# EAGLE design RGB LED 1.1 (EAGLE 5.04)
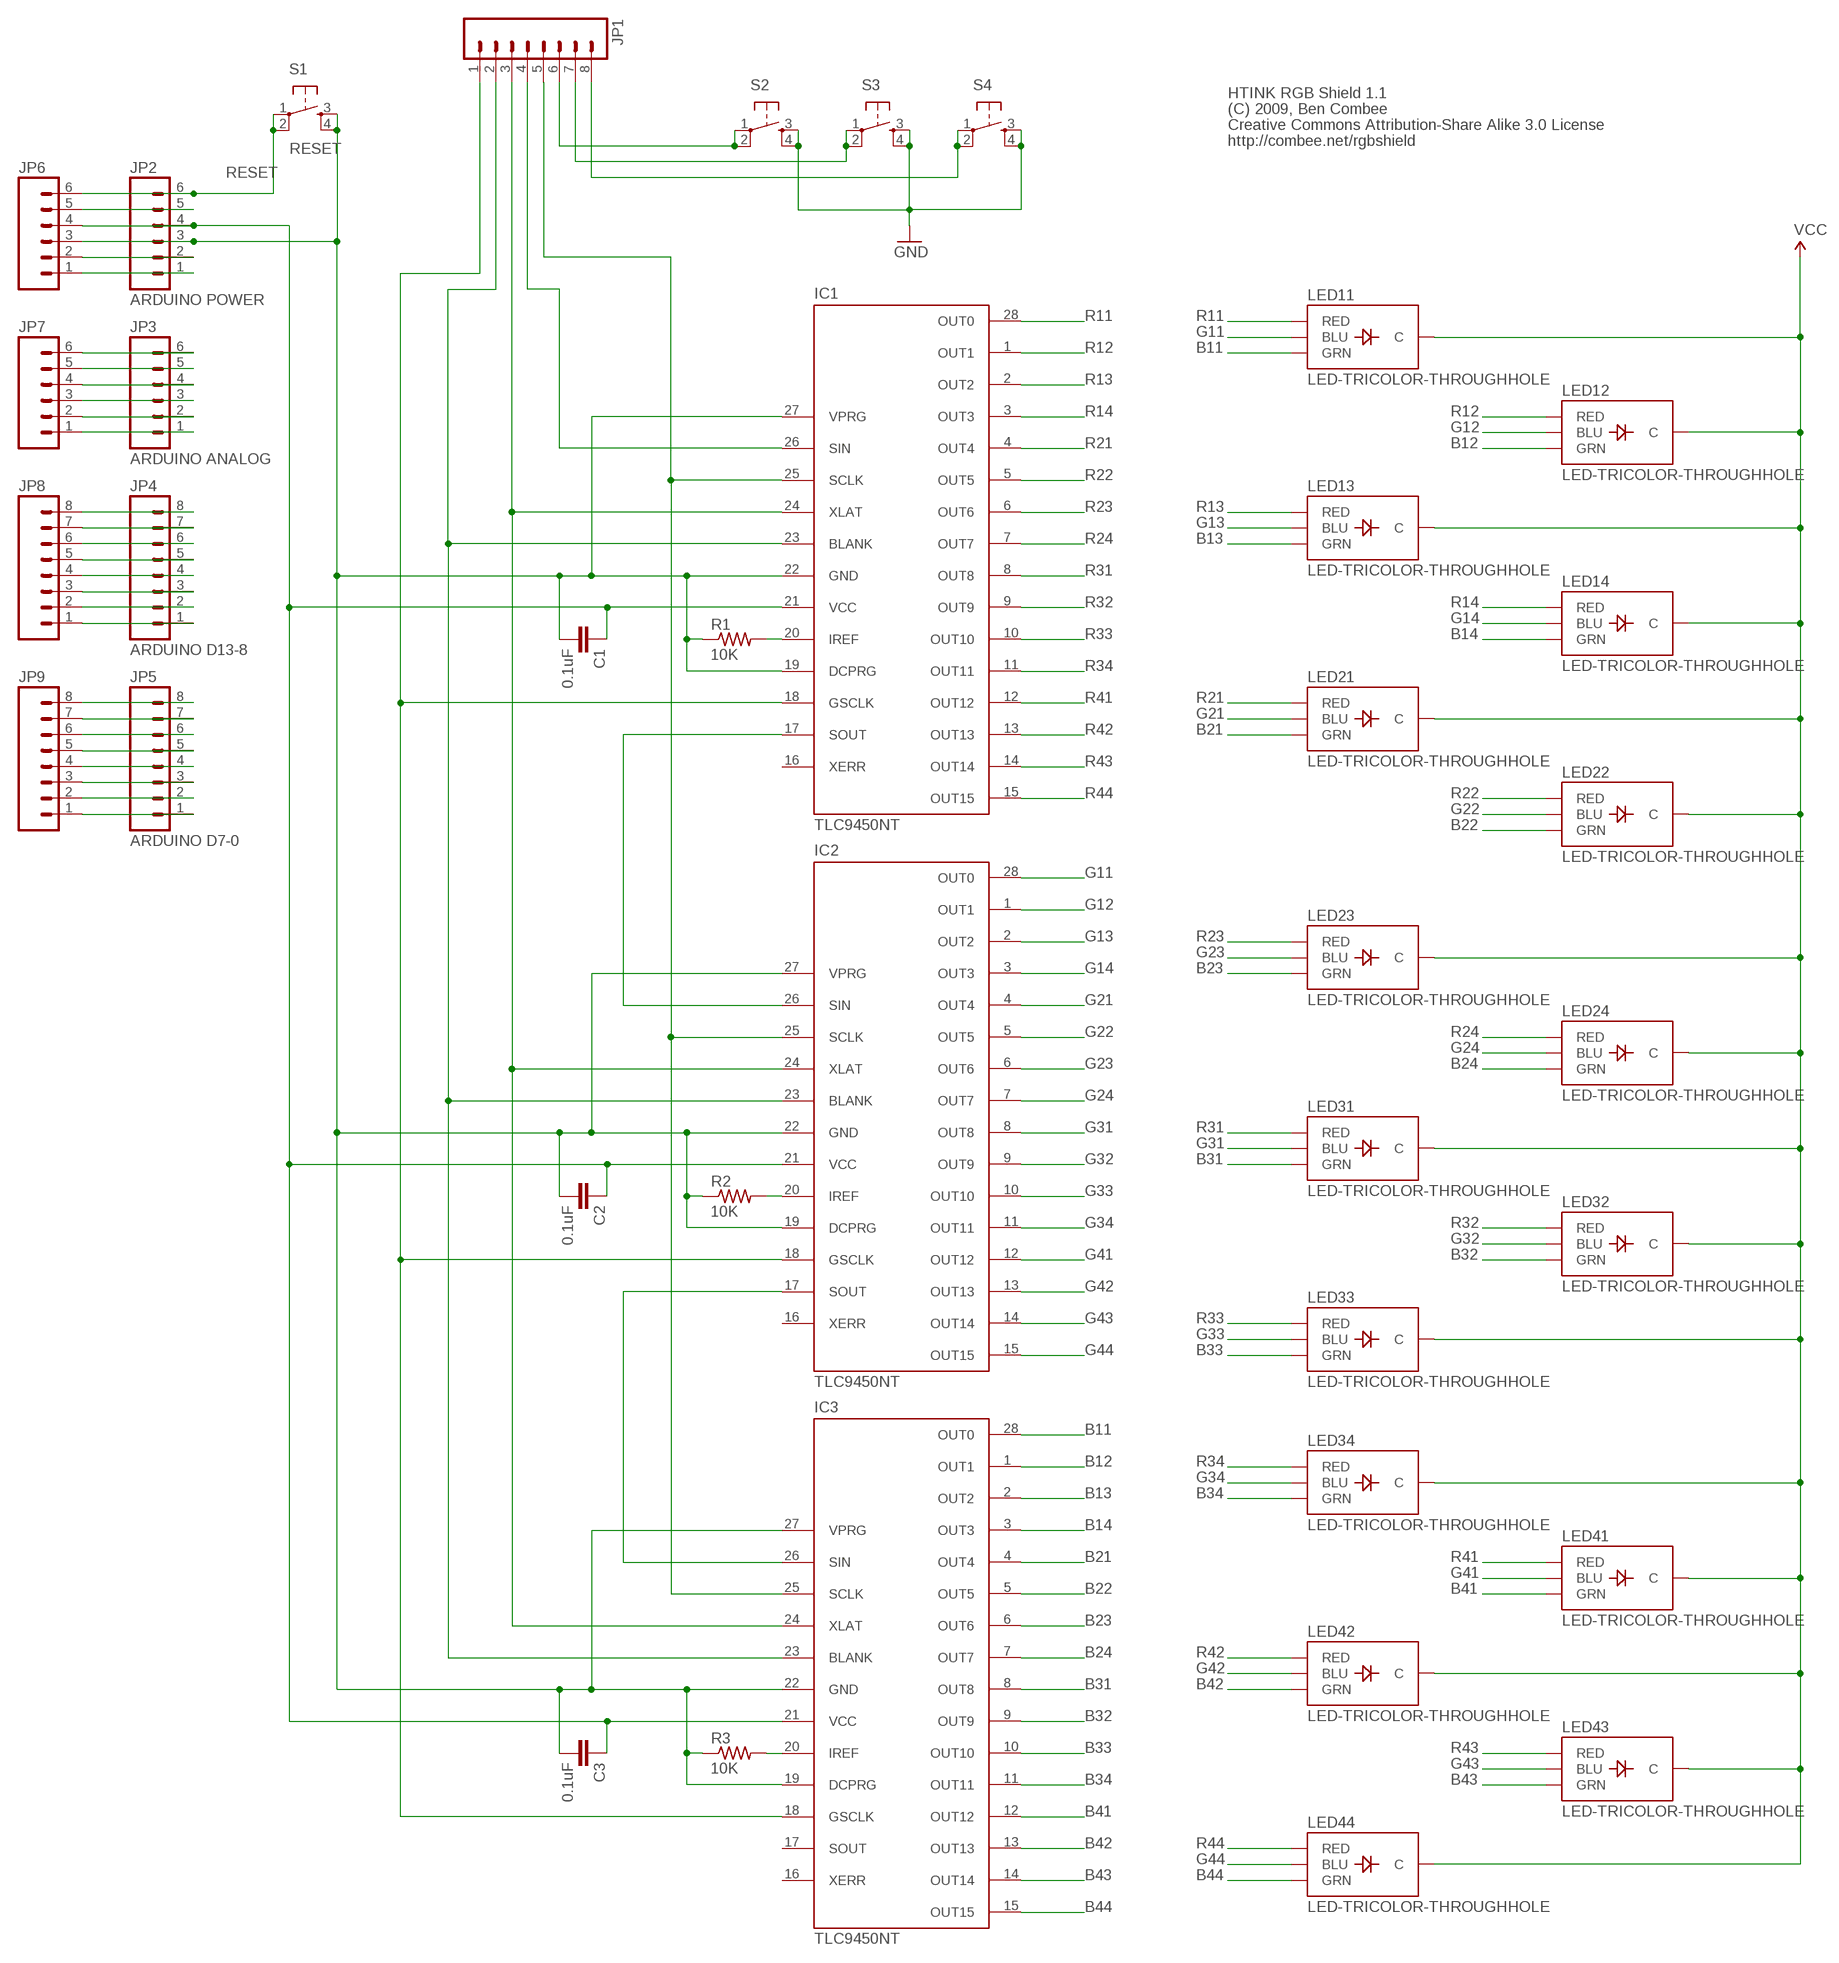
[diagram p0: schematic, sheet 1]

## Parts
C1  0.1uF  CAPPTH  [CAP-PTH-SMALL]
C2  0.1uF  CAPPTH  [CAP-PTH-SMALL]
C3  0.1uF  CAPPTH  [CAP-PTH-SMALL]
IC1  TLC9450NT  [DIL28-3]
IC2  TLC9450NT  [DIL28-3]
IC3  TLC9450NT  [DIL28-3]
JP1  M08LOCK  [1X08_LOCK]
JP2  ARDUINO POWER  M06LOCK  [1X06_LOCK]
JP3  ARDUINO ANALOG  M06LOCK  [1X06_LOCK]
JP4  ARDUINO D13-8  M08LOCK  [1X08_LOCK]
JP5  ARDUINO D7-0  M08LOCK  [1X08_LOCK]
JP6  M06LOCK  [1X06_LOCK]
JP7  M06LOCK  [1X06_LOCK]
JP8  M08LOCK  [1X08_LOCK]
JP9  M08LOCK  [1X08_LOCK]
LED11  LED-TRICOLOR-THROUGHHOLE  [LED-TRICOLOR-THROUGHHOLE]
LED12  LED-TRICOLOR-THROUGHHOLE  [LED-TRICOLOR-THROUGHHOLE]
LED13  LED-TRICOLOR-THROUGHHOLE  [LED-TRICOLOR-THROUGHHOLE]
LED14  LED-TRICOLOR-THROUGHHOLE  [LED-TRICOLOR-THROUGHHOLE]
LED21  LED-TRICOLOR-THROUGHHOLE  [LED-TRICOLOR-THROUGHHOLE]
LED22  LED-TRICOLOR-THROUGHHOLE  [LED-TRICOLOR-THROUGHHOLE]
LED23  LED-TRICOLOR-THROUGHHOLE  [LED-TRICOLOR-THROUGHHOLE]
LED24  LED-TRICOLOR-THROUGHHOLE  [LED-TRICOLOR-THROUGHHOLE]
LED31  LED-TRICOLOR-THROUGHHOLE  [LED-TRICOLOR-THROUGHHOLE]
LED32  LED-TRICOLOR-THROUGHHOLE  [LED-TRICOLOR-THROUGHHOLE]
LED33  LED-TRICOLOR-THROUGHHOLE  [LED-TRICOLOR-THROUGHHOLE]
LED34  LED-TRICOLOR-THROUGHHOLE  [LED-TRICOLOR-THROUGHHOLE]
LED41  LED-TRICOLOR-THROUGHHOLE  [LED-TRICOLOR-THROUGHHOLE]
LED42  LED-TRICOLOR-THROUGHHOLE  [LED-TRICOLOR-THROUGHHOLE]
LED43  LED-TRICOLOR-THROUGHHOLE  [LED-TRICOLOR-THROUGHHOLE]
LED44  LED-TRICOLOR-THROUGHHOLE  [LED-TRICOLOR-THROUGHHOLE]
R1  10K  R-US_0309/12  [0309/12]
R2  10K  R-US_0309/12  [0309/12]
R3  10K  R-US_0309/12  [0309/12]
S1  RESET  TAC_SWITCHPTH  [TACTILE-PTH]
S2  TAC_SWITCHPTH  [TACTILE-PTH]
S3  TAC_SWITCHPTH  [TACTILE-PTH]
S4  TAC_SWITCHPTH  [TACTILE-PTH]

## Nets
B11: IC3.28(OUT0) LED11.GRN
B12: IC3.1(OUT1) LED12.GRN
B13: IC3.2(OUT2) LED13.GRN
B14: IC3.3(OUT3) LED14.GRN
B21: IC3.4(OUT4) LED21.GRN
B22: IC3.5(OUT5) LED22.GRN
B23: IC3.6(OUT6) LED23.GRN
B24: IC3.7(OUT7) LED24.GRN
B31: IC3.8(OUT8) LED31.GRN
B32: IC3.9(OUT9) LED32.GRN
B33: IC3.10(OUT10) LED33.GRN
B34: IC3.11(OUT11) LED34.GRN
B41: IC3.12(OUT12) LED41.GRN
B42: IC3.13(OUT13) LED42.GRN
B43: IC3.14(OUT14) LED43.GRN
B44: IC3.15(OUT15) LED44.GRN
BLANK: IC1.23(BLANK) IC2.23(BLANK) IC3.23(BLANK) JP1.2
G11: IC2.28(OUT0) LED11.BLU
G12: IC2.1(OUT1) LED12.BLU
G13: IC2.2(OUT2) LED13.BLU
G14: IC2.3(OUT3) LED14.BLU
G21: IC2.4(OUT4) LED21.BLU
G22: IC2.5(OUT5) LED22.BLU
G23: IC2.6(OUT6) LED23.BLU
G24: IC2.7(OUT7) LED24.BLU
G31: IC2.8(OUT8) LED31.BLU
G32: IC2.9(OUT9) LED32.BLU
G33: IC2.10(OUT10) LED33.BLU
G34: IC2.11(OUT11) LED34.BLU
G41: IC2.12(OUT12) LED41.BLU
G42: IC2.13(OUT13) LED42.BLU
G43: IC2.14(OUT14) LED43.BLU
G44: IC2.15(OUT15) LED44.BLU
GND: C1.2 C2.2 C3.2 IC1.19(DCPRG) IC1.22(GND) IC1.27(VPRG) IC2.19(DCPRG) IC2.22(GND) IC2.27(VPRG) IC3.19(DCPRG) IC3.22(GND) IC3.27(VPRG) JP2.3 JP6.3 R1.1 R2.1 R3.1 S1.3 S1.4 S2.3 S2.4 S3.3 S3.4 S4.3 S4.4
GSCLK: IC1.18(GSCLK) IC2.18(GSCLK) IC3.18(GSCLK) JP1.1
N$1: IC1.17(SOUT) IC2.26(SIN)
N$2: IC2.17(SOUT) IC3.26(SIN)
N$3: JP1.6 S2.1 S2.2
N$4: IC3.20(IREF) R3.2
N$5: IC2.20(IREF) R2.2
N$6: IC1.20(IREF) R1.2
N$7: JP2.5 JP6.5
N$8: JP2.2 JP6.2
N$9: JP2.1 JP6.1
N$10: JP3.6 JP7.6
N$11: JP3.5 JP7.5
N$12: JP3.4 JP7.4
N$13: JP3.3 JP7.3
N$14: JP3.2 JP7.2
N$15: JP3.1 JP7.1
N$16: JP4.8 JP8.8
N$17: JP4.7 JP8.7
N$18: JP4.6 JP8.6
N$19: JP4.5 JP8.5
N$20: JP4.4 JP8.4
N$21: JP4.3 JP8.3
N$22: JP4.2 JP8.2
N$23: JP4.1 JP8.1
N$24: JP5.8 JP9.8
N$25: JP5.7 JP9.7
N$26: JP5.6 JP9.6
N$27: JP5.5 JP9.5
N$28: JP5.4 JP9.4
N$29: JP5.3 JP9.3
N$30: JP5.2 JP9.2
N$31: JP5.1 JP9.1
N$32: JP1.7 S3.1 S3.2
N$33: JP1.8 S4.1 S4.2
R11: IC1.28(OUT0) LED11.RED
R12: IC1.1(OUT1) LED12.RED
R13: IC1.2(OUT2) LED13.RED
R14: IC1.3(OUT3) LED14.RED
R21: IC1.4(OUT4) LED21.RED
R22: IC1.5(OUT5) LED22.RED
R23: IC1.6(OUT6) LED23.RED
R24: IC1.7(OUT7) LED24.RED
R31: IC1.8(OUT8) LED31.RED
R32: IC1.9(OUT9) LED32.RED
R33: IC1.10(OUT10) LED33.RED
R34: IC1.11(OUT11) LED34.RED
R41: IC1.12(OUT12) LED41.RED
R42: IC1.13(OUT13) LED42.RED
R43: IC1.14(OUT14) LED43.RED
R44: IC1.15(OUT15) LED44.RED
RESET: JP2.6 JP6.6 S1.1 S1.2
SCLK: IC1.25(SCLK) IC2.25(SCLK) IC3.25(SCLK) JP1.5
SIN: IC1.26(SIN) JP1.4
VCC: C1.1 C2.1 C3.1 IC1.21(VCC) IC2.21(VCC) IC3.21(VCC) JP2.4 JP6.4 LED11.GND(C) LED12.GND(C) LED13.GND(C) LED14.GND(C) LED21.GND(C) LED22.GND(C) LED23.GND(C) LED24.GND(C) LED31.GND(C) LED32.GND(C) LED33.GND(C) LED34.GND(C) LED41.GND(C) LED42.GND(C) LED43.GND(C) LED44.GND(C)
XLAT: IC1.24(XLAT) IC2.24(XLAT) IC3.24(XLAT) JP1.3
Unconnected: IC1.16(XERR) IC2.16(XERR) IC3.16(XERR) IC3.17(SOUT)

## Notes on the sheet
- HTINK RGB Shield 1.1
- (C) 2009, Ben Combee
- Creative Commons Attribution-Share Alike 3.0 License
- http://combee.net/rgbshield

## Library data of the parts
C1-C3 = SparkFun:CAP: Capacitor Standard 0603 ceramic capacitor, and 0.1" leaded capacitor.
IC1-IC3 = combee:TLC9450NT: TI TLC5940 16 Channel LED Driver
JP1 JP4 JP5 JP8 JP9 = SparkFun:M08: Header 8 Standard 8-pin 0.1" header. Use with straight break away headers (SKU : PRT-00116), right angle break away headers (PRT-00553), swiss pins (PRT-00743), machine pins (PRT-00117), and female headers (PRT-00115).
JP2 JP3 JP6 JP7 = SparkFun:M06: Header 6 Standard 6-pin 0.1" header. Use with straight break away headers (SKU : PRT-00116), right angle break away headers (PRT-00553), swiss pins (PRT-00743), machine pins (PRT-00117), and female headers (PRT-00115). Molex polarized connector foot print use with SKU : PRT-08094 with associated crimp pins and housings. NOTES ON THE VARIANTS LOCK and LOCK_LONGPADS... This footprint was designed to help hold the alignment of a through-hole component (i.e. 6-pin header) while soldering it into place. You may notice that each hole has been shifted either up or down by 0.005 of an inch from it's more standard position (which is a perfectly straight line). This slight alteration caused the pins (the squares in the middle) to touch the edges of the holes. Because they are alternating, it causes a "brace" to hold the component in place. 0.005 has proven to be the perfect amount of "off-center" position when using our standard breakaway headers. Although looks a little odd when you look at the bare footprint, once you have a header in there, the alteration is very hard to notice. Also, if you push a header all the way into place, it is covered up entirely on the bottom side. This idea of altering the position of holes to aid alignment will be further integrated into the Sparkfun Library for other footprints. It can help hold any component with 3 or more connection pins.
LED11-LED14 LED21-LED24 LED31-LED34 LED41-LED44 = SparkFun:LED-TRICOLOR-THROUGHHOLE
R1-R3 = resistor:R-US_: RESISTOR, American symbol
S1-S4 = SparkFun:TAC_SWITCH: Momentary Switch Button commonly used for reset or general input. Spark Fun Electronics SKU : COM-00097

## Board
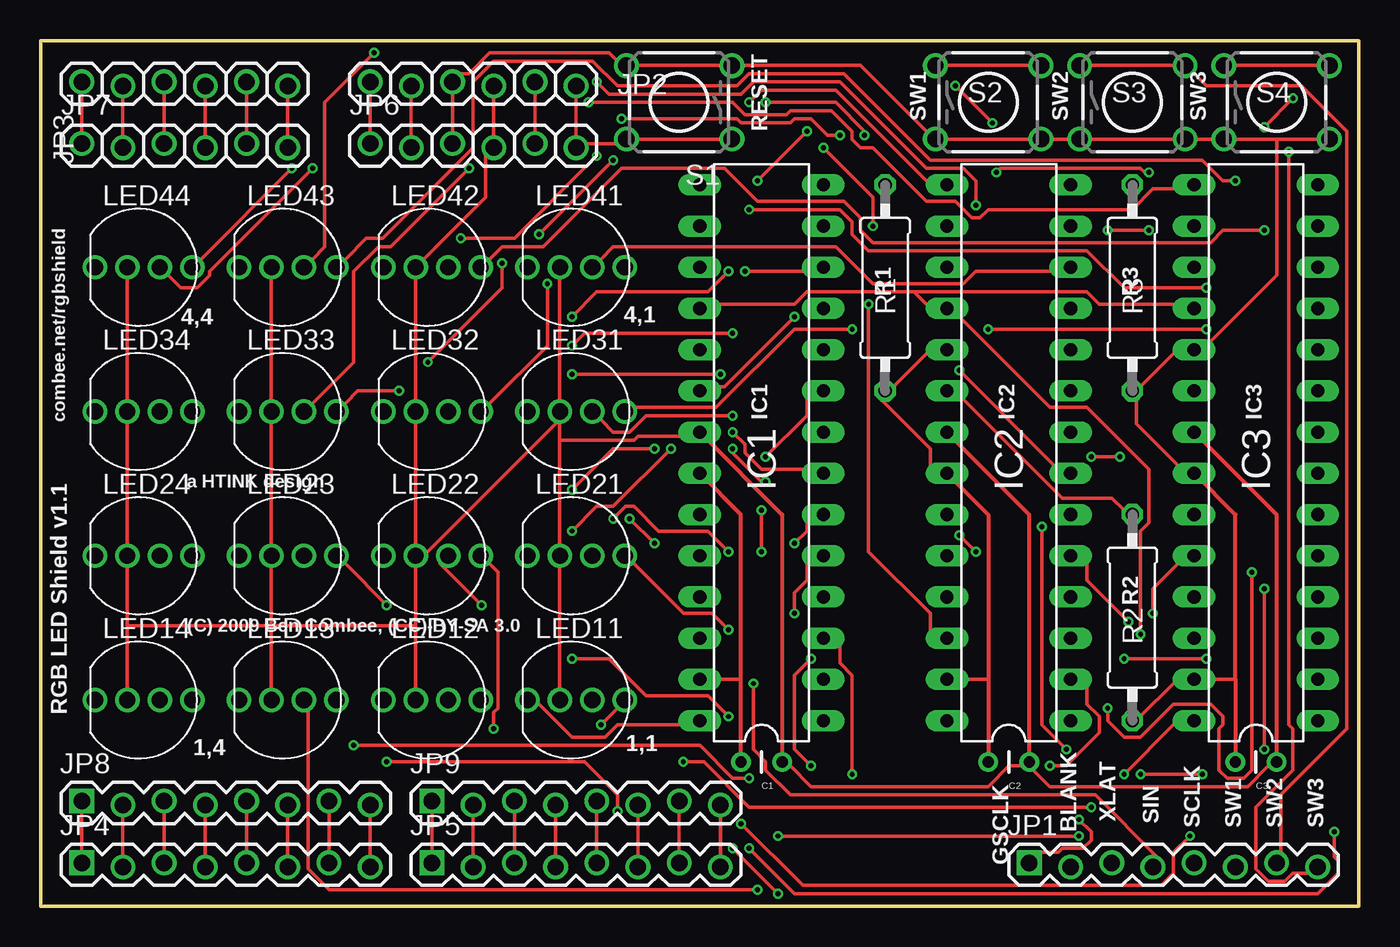
[diagram p1: board, top side]
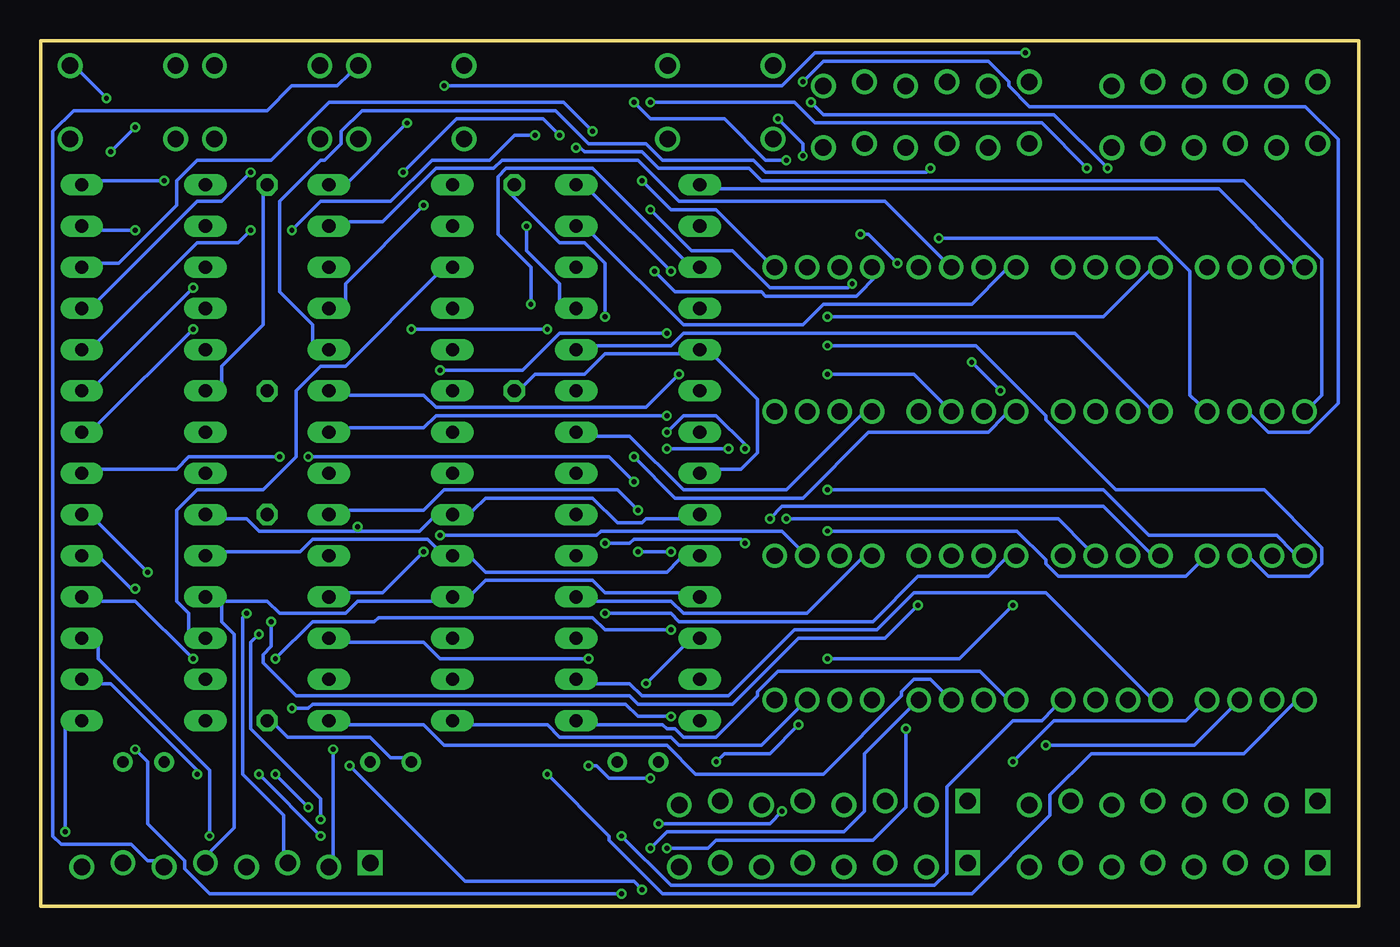
[diagram p2: board, bottom side, seen from below]

Size 81.28 x 53.34 mm. Coordinates in mm from the lower left corner, seen from the top.
Outline: 0,0 81.28,0 81.28,53.34 0,53.34 0,0
Copper layers (1*16): Top 0.035mm / dielectric 1.5mm / Bottom 0.035mm
Design rules "rule_manufacture": minimum track width 8mil, minimum drill 12mil, track to track 8mil, track to pad 8mil, pad to pad 6mil, via to via 10mil, smd to smd 0mil, copper to edge 10mil, drill to drill 10mil, minimum pad ring 10mil, minimum via ring 6mil, stop-mask expansion 2mil, vias tented up to drill 25mil, thermal gap 10mil

### Footprints (pad centres in the part's own frame; a part is rotated, then mirrored left to right if it is on the bottom)
CAP-PTH-SMALL = drill 0.7 round: 1 0,0; 2 2.54,0
DIL28-3 = drill 0.813 long: 1 -16.51,-3.81; 2 -13.97,-3.81; 3 -11.43,-3.81; 4 -8.89,-3.81; 5 -6.35,-3.81; 6 -3.81,-3.81; 7 -1.27,-3.81; 8 1.27,-3.81; 9 3.81,-3.81; 10 6.35,-3.81; 11 8.89,-3.81; 12 11.43,-3.81; 13 13.97,-3.81; 14 16.51,-3.81; 15 16.51,3.81; 16 13.97,3.81; 17 11.43,3.81; 18 8.89,3.81; 19 6.35,3.81; 20 3.81,3.81; 21 1.27,3.81; 22 -1.27,3.81; 23 -3.81,3.81; 24 -6.35,3.81; 25 -8.89,3.81; 26 -11.43,3.81; 27 -13.97,3.81; 28 -16.51,3.81
1X08_LOCK = drill 1.016 square: 1 0,0.127 | drill 1.016 round: 2 2.54,-0.127; 3 5.08,0.127; 4 7.62,-0.127; 5 10.16,0.127; 6 12.7,-0.127; 7 15.24,0.127; 8 17.78,-0.127
1X06_LOCK = drill 1.016 round: 1 0,0; 2 2.54,-0.254; 3 5.08,0; 4 7.62,-0.254; 5 10.16,0; 6 12.7,-0.254
LED-TRICOLOR-THROUGHHOLE = drill 1 round: BLU 1,0; GND -1,0; GRN 3,0; RED -3,0
0309/12 = drill 0.813 octagon: 1 -6.35,0; 2 6.35,0
TACTILE-PTH = drill 1.016 round: 1 -3.251,2.261; 2 3.251,2.261; 3 -3.251,-2.261; 4 3.251,-2.261

### Placement (x,y rotation side)
C1  45.72,8.89 180 top
C2  60.96,8.89 180 top
C3  76.2,8.89 180 top
IC1  44.45,27.94 90 top
IC2  59.69,27.94 90 top
IC3  74.93,27.94 90 top
JP1  60.96,2.54 0 top
JP2  20.32,50.8 0 top
JP3  2.54,50.8 0 top
JP4  2.54,2.54 0 top
JP5  24.13,2.54 0 top
JP6  20.32,46.99 0 top
JP7  2.54,46.99 0 top
JP8  2.54,6.35 0 top
JP9  24.13,6.35 0 top
LED11  33.02,12.7 0 top
LED12  24.13,12.7 0 top
LED13  15.24,12.7 0 top
LED14  6.35,12.7 0 top
LED21  33.02,21.59 0 top
LED22  24.13,21.59 0 top
LED23  15.24,21.59 0 top
LED24  6.35,21.59 0 top
LED31  33.02,30.48 0 top
LED32  24.13,30.48 0 top
LED33  15.24,30.48 0 top
LED34  6.35,30.48 0 top
LED41  33.02,39.37 0 top
LED42  24.13,39.37 0 top
LED43  15.24,39.37 0 top
LED44  6.35,39.37 0 top
R1  52.07,38.1 90 top
R2  67.31,17.78 90 top
R3  67.31,38.1 90 top
S1  39.37,49.53 180 top
S2  58.42,49.53 0 top
S3  67.31,49.53 0 top
S4  76.2,49.53 0 top

### Tracks (layer width: path | path; a pad name or v marks a point on that pad's centre or on a via)
B11  (via drill 0.3)
  Top 0.203: v66.8,8.13 69.85,11.18 IC3.28 | v64.77,6.1 43.69,6.1 40.89,8.89 v39.62,8.89 | v34.54,11.18 35.56,12.19 LED11.GRN
  Bottom 0.203: v64.77,6.1 v66.8,8.13 | v39.62,8.89 39.12,9.4 36.32,9.4 v34.54,11.18
B12  (via drill 0.3)
  Top 0.203: v79.76,4.57 79.76,3.05 80.01,2.79 80.01,2.03 78.74,0.76 46.48,0.76 v43.69,3.56
  Bottom 0.203: v79.76,4.57 79.76,10.92 IC3.1 | v43.69,3.56 42.67,4.57 31.75,4.57 30.48,5.84 30.48,9.4 27.69,12.19 LED12.GRN
B13  (via drill 0.3)
  Top 0.203: v67.82,8.13 v71.63,8.13 | v45.47,4.32 v64.01,4.32
  Bottom 0.203: v71.63,8.13 71.63,8.38 76.96,13.72 77.47,13.72 IC3.2 | v64.01,4.32 v67.82,8.13 | v45.47,4.32 42.42,1.27 26.16,1.27 25.4,2.03 25.4,7.37 21.34,11.43 19.56,11.43 18.8,12.19 LED13.GRN
B14  (via drill 0.3)
  Top 0.203: v70.87,4.32 69.85,3.3 69.85,2.03 69.09,1.27 46.99,1.27 v43.18,5.08 | v35.56,5.84 35.56,6.86 33.53,8.89 v21.34,8.89
  Bottom 0.203: v70.87,4.32 70.87,8.38 77.72,15.24 77.72,16 IC3.3 | v43.18,5.08 36.32,5.08 v35.56,5.84 | v21.34,8.89 18.8,11.43 10.67,11.43 9.91,12.19 LED14.GRN
B21  (via drill 0.3)
  Top 0.203: v66.8,15.24 v71.88,15.24 | v42.42,17.02 41.4,18.03 39.62,18.03 36.58,21.08 LED21.GRN
  Bottom 0.203: v71.88,15.24 75.44,18.8 77.47,18.8 IC3.4 | v66.8,15.24 64.52,17.53 60.71,17.53 60.45,17.78 47.24,17.78 46.48,17.02 v42.42,17.02
B22  (via drill 0.3)
  Top 0.203: v75.44,9.65 v75.44,19.56 | v42.67,3.56 v45.47,0.76 | v27.94,10.92 27.94,11.94 28.19,12.19 28.19,20.57 27.69,21.08 LED22.GRN
  Bottom 0.203: v75.44,19.56 75.69,19.56 77.47,21.34 IC3.5 | v75.44,9.65 74.68,8.89 74.68,5.08 72.39,2.79 72.39,2.29 70.87,0.76 v45.47,0.76 | v42.67,3.56 40.13,3.56 39.62,4.06 29.97,4.06 27.94,6.1 v27.94,10.92
B23  (via drill 0.3)
  Top 0.203: v74.68,20.57 74.68,8.38 74.17,7.87 73.15,7.87 72.64,8.38 72.64,10.92 72.9,11.18 72.9,11.68 72.14,12.45 69.85,12.45 67.82,10.41 66.8,10.41 65.79,11.43 v65.79,12.19 | v42.42,11.68 41.15,12.95 37.34,12.95 35.05,15.24 v32.77,15.24 | v21.34,18.54 18.8,21.08 LED23.GRN
  Bottom 0.203: v74.68,20.57 77.72,23.62 IC3.6 | v65.79,12.19 64.77,12.19 64.52,12.45 45.21,12.45 44.45,11.68 v42.42,11.68 | v32.77,15.24 24.64,15.24 v21.34,18.54
B24  (via drill 0.3)
  Top 0.203: v64.77,27.69 v66.55,27.69 | v44.7,26.16 44.45,26.16 42.67,27.94 v42.67,28.19 | v38.86,28.19 35.31,24.64 34.29,24.64 v32.77,23.11
  Bottom 0.203: v66.55,27.69 72.14,27.69 72.9,26.92 77.47,26.92 IC3.7 | v64.77,27.69 46.23,27.69 v44.7,26.16 | v38.86,28.19 v42.67,28.19 | v32.77,23.11 21.08,23.11 19.3,21.34 19.3,21.08 18.54,20.32 10.67,20.32 9.91,21.08 LED24.GRN
B31  (via drill 0.3)
  Top 0.203: v58.42,35.56 v71.88,35.56 | v50.04,35.56 46.48,35.56 41.66,30.73 36.58,30.73 LED31.GRN
  Bottom 0.203: v71.88,35.56 77.72,29.72 IC3.8 | v50.04,35.56 v58.42,35.56
B32  (via drill 0.3)
  Top 0.203: v71.88,38.1 66.8,38.1 64.52,40.39 51.05,40.39 50.04,41.4 50.04,42.16 49.28,42.93 v43.69,42.93 | v31.24,38.35 31.24,34.54 27.69,30.99 LED32.GRN
  Bottom 0.203: v71.88,38.1 77.72,32.26 IC3.9 | v43.69,42.93 41.15,40.39 38.61,40.39 36.32,38.1 31.5,38.1 v31.24,38.35
B33  (via drill 0.3)
  Top 0.203: v65.79,41.66 v68.33,41.66 | v50.8,47.5 50.8,47.75 49.02,49.53 v44.7,49.53 | v30.73,41.4 v35.31,45.97 | v28.45,39.62 28.45,38.1 v23.88,33.53 | v22.1,31.75 19.56,31.75 18.8,30.99 LED33.GRN
  Bottom 0.203: v68.33,41.66 69.09,40.89 71.63,40.89 77.72,34.8 IC3.10 | v65.79,41.66 64.01,43.43 59.69,43.43 57.15,45.97 53.59,45.97 52.07,47.5 v50.8,47.5 | v44.7,49.53 43.69,48.51 39.12,48.51 36.58,45.97 v35.31,45.97 | v30.73,41.4 30.23,41.4 v28.45,39.62 | v22.1,31.75 v23.88,33.53
B34  (via drill 0.3)
  Top 0.203: v68.33,45.21 68.07,45.21 67.82,45.47 59.18,45.47 v58.93,45.21 | v49.28,47.5 48.51,47.5 47.5,48.51 46.48,48.51 46.23,48.26 43.18,48.26 42.93,48.51 v35.81,48.51 | v34.29,46.23 29.21,41.15 v25.91,41.15
  Bottom 0.203: v68.33,45.21 70.1,43.43 71.63,43.43 77.72,37.34 IC3.11 | v58.93,45.21 55.63,48.51 50.29,48.51 v49.28,47.5 | v35.81,48.51 34.29,46.99 v34.29,46.23 | v25.91,41.15 12.45,41.15 10.41,39.12 10.41,31.5 9.91,30.99 LED34.GRN
B41  (via drill 0.3)
  Top 0.203: v44.2,44.7 v47.24,47.75
  Bottom 0.203: v47.24,47.75 49.02,49.53 63.5,49.53 67.06,45.97 71.63,45.97 72.9,44.7 72.9,43.18 76.45,39.62 77.47,39.62 IC3.12 | v44.2,44.7 42.42,42.93 39.62,42.93 36.58,39.88 LED41.GRN
B42  (via drill 0.3)
  Top 0.203: v75.44,41.66 72.9,41.66 72.14,40.89 51.31,40.89 50.55,41.66 50.55,42.42 49.53,43.43 44.2,43.43 42.16,45.47 35.81,45.47 30.99,40.64 28.45,40.64 27.69,39.88 LED42.GRN
  Bottom 0.203: v75.44,41.66 77.47,41.66 IC3.13
B43  (via drill 0.3)
  Top 0.203: v73.66,44.7 72.9,44.7 71.63,45.97 54.86,45.97 49.53,51.31 43.69,51.31 42.93,50.55 35.56,50.55 34.04,52.07 27.94,52.07 26.67,50.8 26.67,46.74 21.08,41.15 20.07,41.15 18.8,39.88 LED43.GRN
  Bottom 0.203: v73.66,44.7 77.47,44.7 IC3.14
B44  (via drill 0.3)
  Top 0.203: v33.78,49.53 42.67,49.53 43.43,48.77 45.97,48.77 46.23,49.02 48.77,49.02 50.04,47.75 50.04,47.24 50.55,46.74 51.31,46.74 54.61,43.43 56.39,43.43 57.4,42.42 57.91,42.42 58.42,42.93 67.31,42.93 68.58,44.2 69.85,44.2 IC3.15 | v15.49,45.47 9.91,39.88 LED44.GRN
  Bottom 0.203: v33.78,49.53 33.02,48.77 18.8,48.77 v15.49,45.47
BLANK  (via drill 0.3)
  Top 0.203: v63.25,9.65 61.72,11.18 v61.72,23.37
  Bottom 0.203: IC1.23 41.91,23.88 43.94,23.88 44.2,23.62 45.72,23.62 47.24,25.15 53.85,25.15 54.61,24.38 IC2.23 57.15,23.88 57.91,23.11 61.72,23.11 | 61.72,23.11 67.82,23.11 68.58,23.88 69.85,23.88 IC3.23 | v63.25,9.65 63.25,3.05 JP1.2 | v61.72,23.37 61.72,23.11
G11
  Bottom 0.203: IC2.28 54.61,11.18 50.04,11.18 49.28,10.41 42.42,10.41 41.91,9.91 36.83,9.91 34.54,12.19 LED11.BLU
G12
  Bottom 0.203: IC2.1 62.23,11.18 57.66,11.18 56.39,9.91 42.67,9.91 40.89,8.13 33.02,8.13 28.19,12.95 28.19,13.21 27.43,13.97 26.42,13.97 25.65,13.21 LED12.BLU
G13  (via drill 0.3)
  Top 0.203: v62.23,8.64 63.25,8.64 65.28,10.67 65.28,11.68 64.52,12.45 64.52,13.46 IC2.2 | v44.2,1.02 17.78,1.02 16.51,2.29 16.51,12.19 LED13.BLU
  Bottom 0.203: v62.23,8.64 55.12,1.52 44.7,1.52 v44.2,1.02
G14  (via drill 0.3)
  Top 0.203: v47.5,15.24 46.48,14.22 46.48,9.65 v47.5,8.64 | v43.69,7.87 42.67,7.87 40.64,9.91 v19.3,9.91
  Bottom 0.203: v47.5,15.24 56.64,15.24 57.66,16.26 62.23,16.26 IC2.3 | v47.5,8.64 46.99,8.64 46.23,7.87 v43.69,7.87 | v19.3,9.91 10.16,9.91 7.87,12.19 LED14.BLU
G21  (via drill 0.3)
  Top 0.203: v56.64,22.86 v57.66,21.84
  Bottom 0.203: v57.66,21.84 60.2,19.3 62.23,19.3 IC2.4 | v56.64,22.86 46.99,22.86 46.74,23.11 35.56,23.11 34.54,22.1 LED21.BLU
G22  (via drill 0.3)
  Top 0.203: v67.06,17.53 64.52,20.07 64.52,21.08 IC2.5 | v27.18,18.54 24.64,21.08 LED22.BLU
  Bottom 0.203: v67.06,17.53 67.06,16 67.56,15.49 67.56,14.99 65.53,12.95 44.96,12.95 44.45,12.45 38.61,12.45 34.54,16.51 29.21,16.51 v27.18,18.54
G23  (via drill 0.3)
  Top 0.203: v44.45,21.84 v44.45,24.38 | v42.42,21.84 41.15,23.11 38.1,23.11 36.58,24.64 36.07,24.64 v35.31,23.88
  Bottom 0.203: v44.45,24.38 45.72,25.65 56.39,25.65 57.66,24.38 62.23,24.38 IC2.6 | v42.42,21.84 v44.45,21.84 | v35.31,23.88 18.54,23.88 16.76,22.1 LED23.BLU
G24  (via drill 0.3)
  Top 0.203: v56.64,33.02 62.48,27.18 IC2.7 | v42.67,35.31 33.53,35.31 v32.77,34.54
  Bottom 0.203: v56.64,33.02 51.56,33.02 49.28,35.31 v42.67,35.31 | v32.77,34.54 23.62,34.54 19.3,30.23 19.3,29.97 14.99,25.65 5.84,25.65 2.29,22.1 2.29,21.08 3.05,20.32 5.59,20.32 6.6,21.34 LED24.BLU
G31  (via drill 0.3)
  Top 0.203: v42.67,30.23 37.34,30.23 36.32,29.21 35.31,29.21 34.54,29.97 LED31.BLU
  Bottom 0.203: v42.67,30.23 56.9,30.23 57.66,29.46 62.23,29.46 IC2.8
G32  (via drill 0.3)
  Top 0.203: v32.77,32.77 v41.91,32.77
  Bottom 0.203: v41.91,32.77 43.94,30.73 56.9,30.73 57.66,31.5 62.23,31.5 IC2.9 | v32.77,32.77 27.43,32.77 25.65,30.99 LED32.BLU
G33  (via drill 0.3)
  Top 0.203: v26.42,45.47 21.59,40.64 20.83,40.64 19.3,39.12 19.3,33.53 16.76,30.99 LED33.BLU
  Bottom 0.203: v26.42,45.47 26.67,45.21 36.58,45.21 37.34,45.97 42.93,45.97 43.94,46.99 47.5,46.99 49.53,49.02 61.47,49.02 62.74,47.75 62.74,46.99 63.75,45.97 64.01,45.97 66.55,43.43 66.55,37.85 64.52,35.81 64.52,34.8 IC2.10
G34  (via drill 0.3)
  Top 0.203: v57.66,43.18 57.66,44.7 56.9,45.47 54.61,45.47 49.28,50.8 43.94,50.8 43.18,50.04 35.05,50.04 v34.29,50.8
  Bottom 0.203: v57.66,43.18 62.48,38.35 62.48,37.34 IC2.11 | v34.29,50.8 33.02,52.07 22.86,52.07 21.59,50.8 21.59,50.55 20.32,49.28 3.3,49.28 1.27,47.24 1.27,30.99 3.05,29.21 5.59,29.21 6.6,30.23 LED34.BLU
G41
  Top 0.203: IC2.12 62.23,39.12 57.66,39.12 56.9,38.35 51.31,38.35 49.02,40.64 35.31,40.64 34.54,39.88 LED41.BLU
G42
  Bottom 0.203: IC2.13 62.23,42.16 60.2,42.16 56.9,45.47 53.34,45.47 52.83,45.97 44.45,45.97 41.91,43.43 29.21,43.43 25.65,39.88 LED42.BLU
G43  (via drill 0.3)
  Top 0.203: v56.39,50.55 v58.67,48.26 | v20.57,52.58 17.53,49.53 17.53,40.64 16.76,39.88 LED43.BLU
  Bottom 0.203: v58.67,48.26 62.23,44.7 IC2.14 | v56.39,50.55 35.56,50.55 33.53,52.58 v20.57,52.58
G44  (via drill 0.3)
  Top 0.203: v43.69,49.53 44.45,50.29 49.02,50.29 54.61,44.7 IC2.15 | v16.76,45.47 10.41,39.12 10.41,38.86 9.65,38.1 8.64,38.1 7.87,38.86 LED44.BLU
  Bottom 0.203: v43.69,49.53 34.8,49.53 33.53,48.26 19.56,48.26 v16.76,45.47
GND
  Top 0.203: 58.42,13.97 IC2.27 | 43.18,13.97 IC1.27 | IC2.19 54.61,34.04 52.58,32 R1.1 51.82,31.24 54.86,28.19 54.86,27.18 IC2.22 | R2.1 67.82,11.68 69.85,13.72 IC3.27 73.66,13.97 | IC3.22 70.1,27.18 67.56,29.72 67.56,31.24 R3.1 67.82,32 69.85,34.04 IC3.19 72.14,34.8 76.2,38.86 76.2,47.24 | JP6.3 JP2.3 25.91,51.31 26.42,51.31 27.69,52.58 35.05,52.58 35.56,52.07 S1.4 36.83,51.82 41.91,51.82 S1.3 43.18,51.82 50.55,51.82 54.61,47.75 S2.3 55.88,47.24 60.96,47.24 S2.4 62.23,47.24 63.5,47.24 S3.3 64.77,47.24 69.85,47.24 S3.4 71.12,47.24 72.39,47.24 S4.3 73.66,47.24 76.2,47.24 | 76.2,47.24 78.74,47.24 S4.4
  Top 0.254: C1.2 43.18,13.97 43.18,24.13 IC1.22 | C2.2 58.42,13.97 58.42,24.13 IC2.22 | C3.2 73.66,13.97 73.66,24.13 IC3.22
  Bottom 0.203: R1.1 51.56,32 50.8,32.77 47.75,32.77 46.48,34.04 41.91,34.04 IC1.19 39.62,33.78 37.08,31.24 37.08,27.94 38.1,26.92 39.37,26.92 IC1.22 | C2.2 58.93,9.14 59.69,9.14 60.96,10.41 66.04,10.41 66.8,11.18 R2.1
GSCLK  (via drill 0.3)
  Top 0.203: 53.85,37.85 47.24,37.85 46.48,37.08 41.91,37.08 IC1.18 | 53.85,37.85 54.61,37.08 IC2.18 56.64,36.32 62.23,30.73 64.52,30.73 68.33,26.92 68.33,23.62 67.82,23.11 v67.82,16.76 | 53.85,37.85 64.52,37.85 65.28,37.08 69.85,37.08 IC3.18 | v64.01,5.33 64.77,4.57 64.77,4.06 64.26,3.56 62.99,3.56 62.74,3.3 61.47,3.3 JP1.1
  Bottom 0.203: v64.01,5.33 64.01,6.6 68.33,10.92 68.33,16.26 v67.82,16.76
N$1  (via drill 0.3)
  Top 0.203: v51.05,37.08 51.05,21.84 54.86,18.03 54.86,17.02 IC2.26
  Bottom 0.203: v51.05,37.08 51.05,39.37 53.09,41.4 53.09,44.96 52.58,45.47 47.24,45.47 41.66,39.88 IC1.17
N$2
  Bottom 0.203: IC3.26 72.14,17.02 72.14,18.03 72.9,18.8 72.9,24.38 71.63,25.65 67.56,25.65 65.53,27.69 65.53,31.75 64.01,33.27 62.48,33.27 56.9,38.86 IC2.17
N$3
  Top 0.203: S2.1 55.88,51.82 60.96,51.82 S2.2
  Bottom 0.203: JP1.6 74.17,2.79 74.68,2.79 75.69,3.81 80.01,3.81 80.52,4.32 80.52,47.75 79.25,49.02 67.31,49.02 65.79,50.55 62.99,50.55 62.23,51.31 S2.2
N$4
  Bottom 0.203: IC3.20 70.1,32.26 70.1,33.27 67.56,35.81 67.56,43.94 R3.2
N$5
  Top 0.203: IC2.20 56.9,31.24 62.99,25.15 66.04,25.15 66.8,24.38 R2.2
N$6  (via drill 0.3)
  Top 0.203: v46.48,36.32 42.16,32 41.91,32 IC1.20
  Bottom 0.203: v46.48,36.32 46.48,39.62 47.75,40.89 49.28,40.89 52.32,43.94 R1.2
N$7
  Top 0.203: JP6.5 JP2.5
N$8
  Top 0.203: JP6.2 JP2.2
N$9
  Top 0.203: JP6.1 JP2.1
N$10
  Top 0.203: JP7.6 JP3.6
N$11
  Top 0.203: JP7.5 JP3.5
N$12
  Top 0.203: JP7.4 JP3.4
N$13
  Top 0.203: JP7.3 JP3.3
N$14
  Top 0.203: JP7.2 JP3.2
N$15
  Top 0.203: JP7.1 JP3.1
N$16
  Top 0.203: JP4.8 JP8.8
N$17
  Top 0.203: JP4.7 JP8.7
N$18
  Top 0.203: JP4.6 JP8.6
N$19
  Top 0.203: JP4.5 JP8.5
N$20
  Top 0.203: JP4.4 JP8.4
N$21
  Top 0.203: JP4.3 JP8.3
N$22
  Top 0.203: JP4.2 JP8.2
N$23
  Top 0.203: JP4.1 JP8.1
N$24
  Top 0.203: JP5.8 JP9.8
N$25
  Top 0.203: JP5.7 JP9.7
N$26
  Top 0.203: JP5.6 JP9.6
N$27
  Top 0.203: JP5.5 JP9.5
N$28
  Top 0.203: JP5.4 JP9.4
N$29
  Top 0.203: JP5.3 JP9.3
N$30
  Top 0.203: JP5.2 JP9.2
N$31
  Top 0.203: JP5.1 JP9.1
N$32
  Top 0.203: JP1.7 76.45,3.3 76.45,6.86 80.52,10.92 80.52,47.75 77.72,50.55 71.88,50.55 71.12,51.31 S3.2 69.85,51.82 64.77,51.82 S3.1
N$33  (via drill 0.3)
  Top 0.203: v76.96,46.48 76.96,11.18 77.22,10.92 77.22,8.38 74.93,6.1 74.93,2.29 75.69,1.52 76.71,1.52 77.22,2.03 78.23,2.03 JP1.8 | v75.44,48.01 v77.22,49.78 | S4.1 73.66,51.82 78.74,51.82 S4.2
  Bottom 0.203: v76.96,46.48 v75.44,48.01 | v77.22,49.78 78.99,51.56 S4.2
R11
  Top 0.203: IC1.28 39.37,11.18 35.56,11.18 34.8,10.41 32.77,10.41 30.73,12.45 LED11.RED
R12
  Bottom 0.203: IC1.1 46.99,11.18 42.93,11.18 42.67,10.92 42.16,10.92 41.66,10.41 39.62,10.41 37.08,12.95 37.08,13.21 35.81,14.48 23.37,14.48 21.84,12.95 LED12.RED
R13
  Bottom 0.203: IC1.2 46.99,13.72 44.96,13.72 44.2,12.95 38.86,12.95 34.8,17.02 29.72,17.02 27.43,19.3 19.3,19.3 12.95,12.95 LED13.RED
R14  (via drill 0.3)
  Top 0.203: v50.04,8.13 50.04,14.22 49.28,14.99 49.28,16 IC1.3
  Bottom 0.203: v50.04,8.13 46.23,4.32 46.23,4.06 42.93,0.76 23.88,0.76 19.05,5.59 19.05,6.86 16.51,9.4 7.11,9.4 4.06,12.45 LED14.RED
R21
  Bottom 0.203: IC1.4 46.99,18.8 42.42,18.8 41.66,18.03 34.04,18.03 30.73,21.34 LED21.RED
R22  (via drill 0.3)
  Top 0.203: v46.48,18.03 46.48,19.3 47.24,20.07 47.24,21.08 IC1.5
  Bottom 0.203: v46.48,18.03 42.42,18.03 41.91,17.53 29.97,17.53 27.18,20.32 22.86,20.32 21.84,21.34 LED22.RED
R23  (via drill 0.3)
  Top 0.203: v46.48,22.35 47.24,23.11 47.24,23.62 IC1.6 | v36.32,23.88 v37.85,22.35
  Bottom 0.203: v46.48,22.35 44.96,22.35 44.7,22.61 38.1,22.61 v37.85,22.35 | v36.32,23.88 35.56,24.64 15.75,24.64 12.95,21.84 LED23.RED
R24  (via drill 0.3)
  Top 0.203: v42.67,29.21 43.43,28.45 43.43,27.94 44.45,26.92 46.99,26.92 IC1.7 | v37.85,28.19 35.31,28.19 v32.77,25.65
  Bottom 0.203: v42.67,29.21 41.66,30.23 39.62,30.23 37.85,28.45 v37.85,28.19 | v32.77,25.65 15.75,25.65 12.95,22.86 5.08,22.86 4.06,21.84 LED24.RED
R31
  Bottom 0.203: IC1.8 46.99,28.96 44.96,28.96 41.66,25.65 35.31,25.65 30.73,30.23 LED31.RED
R32  (via drill 0.3)
  Top 0.203: v44.7,27.69 47.24,30.23 47.24,31.24 IC1.9
  Bottom 0.203: v44.7,27.69 42.16,25.15 34.29,25.15 30.23,29.21 22.86,29.21 21.84,30.23 LED32.RED
R33
  Bottom 0.203: IC1.10 46.99,34.54 42.42,34.54 41.66,35.31 17.53,35.31 12.95,30.73 LED33.RED
R34  (via drill 0.3)
  Top 0.203: v51.31,41.91 51.31,43.69 v48.26,46.74
  Bottom 0.203: v51.31,41.91 51.31,40.39 49.28,38.35 49.28,37.34 IC1.11 | v48.26,46.74 48.01,46.74 47.75,46.48 44.2,46.48 43.18,45.47 37.59,45.47 36.83,44.7 7.11,44.7 2.29,39.88 2.29,31.5 2.79,30.99 LED34.RED
R41  (via drill 0.3)
  Top 0.203: v43.43,39.12 46.99,39.12 IC1.12
  Bottom 0.203: v43.43,39.12 42.16,37.85 36.83,37.85 36.58,37.59 30.99,37.59 29.72,38.86 LED41.RED
R42
  Bottom 0.203: IC1.13 47.24,41.4 41.66,35.81 34.29,35.81 33.02,37.08 23.88,37.08 21.84,39.12 LED42.RED
R43  (via drill 0.3)
  Top 0.203: v42.42,39.12 41.15,37.85 34.29,37.85 v32.77,36.32
  Bottom 0.203: v42.42,39.12 47.24,43.94 IC1.14 | v32.77,36.32 15.75,36.32 12.95,39.12 LED43.RED
R44
  Bottom 0.203: IC1.15 39.37,44.2 8.64,44.2 4.06,39.62 LED44.RED
RESET
  Top 0.203: JP2.6 JP6.6 33.53,46.99 35.56,46.99 S1.2 36.83,47.24 41.91,47.24 S1.1
SCLK
  Bottom 0.203: IC1.25 41.91,19.3 46.48,19.3 47.24,20.07 53.85,20.07 54.61,19.3 IC2.25 57.15,18.8 61.72,18.8 62.48,18.03 66.55,18.03 67.31,18.8 69.85,18.8 IC3.25 70.1,18.54 70.1,17.53 69.34,16.76 69.34,4.83 70.87,3.3 JP1.5
SIN  (via drill 0.3)
  Top 0.203: v43.94,13.72 43.94,9.65 44.7,8.89 44.7,8.38 46.23,6.86 65.02,6.86 68.83,3.05 JP1.4
  Bottom 0.203: v43.94,13.72 41.66,16 IC1.26
VCC
  Top 0.203: 5.33,17.27 5.33,21.08 LED24.GND 5.33,22.1 5.33,29.97 LED34.GND 5.33,30.99 5.33,38.86 LED44.GND | 5.33,17.27 5.33,13.21 LED14.GND | 14.22,17.27 14.22,21.08 LED23.GND 14.22,22.1 14.22,29.97 LED33.GND 14.22,30.99 14.22,38.86 LED43.GND | 14.22,17.27 14.22,13.21 LED13.GND | 5.33,17.27 14.22,17.27 | 23.11,17.27 23.11,21.08 LED22.GND | 23.11,17.27 23.11,13.21 LED12.GND | JP2.4 JP6.4 27.43,46.23 27.43,43.69 23.62,39.88 LED42.GND 23.11,38.86 23.11,30.99 LED32.GND 23.11,29.97 23.11,22.1 LED22.GND | 14.22,17.27 23.11,17.27 | C3.1 75.69,8.64 74.42,7.37 62.23,7.37 61.21,8.38 C2.1 60.45,8.64 59.69,8.64 58.42,7.37 47.5,7.37 46.23,8.64 C1.1 | LED11.GND 32,13.21 32,21.08 LED21.GND 32,22.1 32,28.7 | LED41.GND 32,38.86 32,30.99 LED31.GND 32,29.97 | 32,29.97 32,28.7 | 32,28.7 36.58,28.7 36.83,28.96 39.37,28.96 IC1.21 | 32,29.97 23.88,21.84 LED22.GND
  Top 0.254: C1.1 45.72,24.13 IC1.21 | C2.1 60.96,24.13 IC2.21 | C3.1 76.2,24.13 IC3.21
XLAT  (via drill 0.3)
  Top 0.203: v68.58,18.03 68.58,19.56 70.1,21.08 IC3.24
  Bottom 0.203: IC1.24 41.91,21.34 42.67,20.57 53.85,20.57 54.61,21.34 IC2.24 56.9,22.1 57.4,22.61 64.52,22.61 65.28,21.84 69.85,21.84 IC3.24 | v68.58,18.03 68.83,17.78 68.83,8.13 66.29,5.59 66.29,3.3 JP1.3

### Text on the board
tPlace: RESET | SW1 | SW2 | SW3 | R1 | R3 | 4,4 | 4,1 | combee.net/rgbshield | IC1 | IC2 | IC3 | a HTINK design | R2 | (C) 2009 Ben Combee, (CC)-BY-SA 3.0 | RGB LED Shield v1.1 | 1,1 | 1,4 | BLANK | XLAT | SIN | SCLK | SW1 | SW2 | SW3 | GSCLK